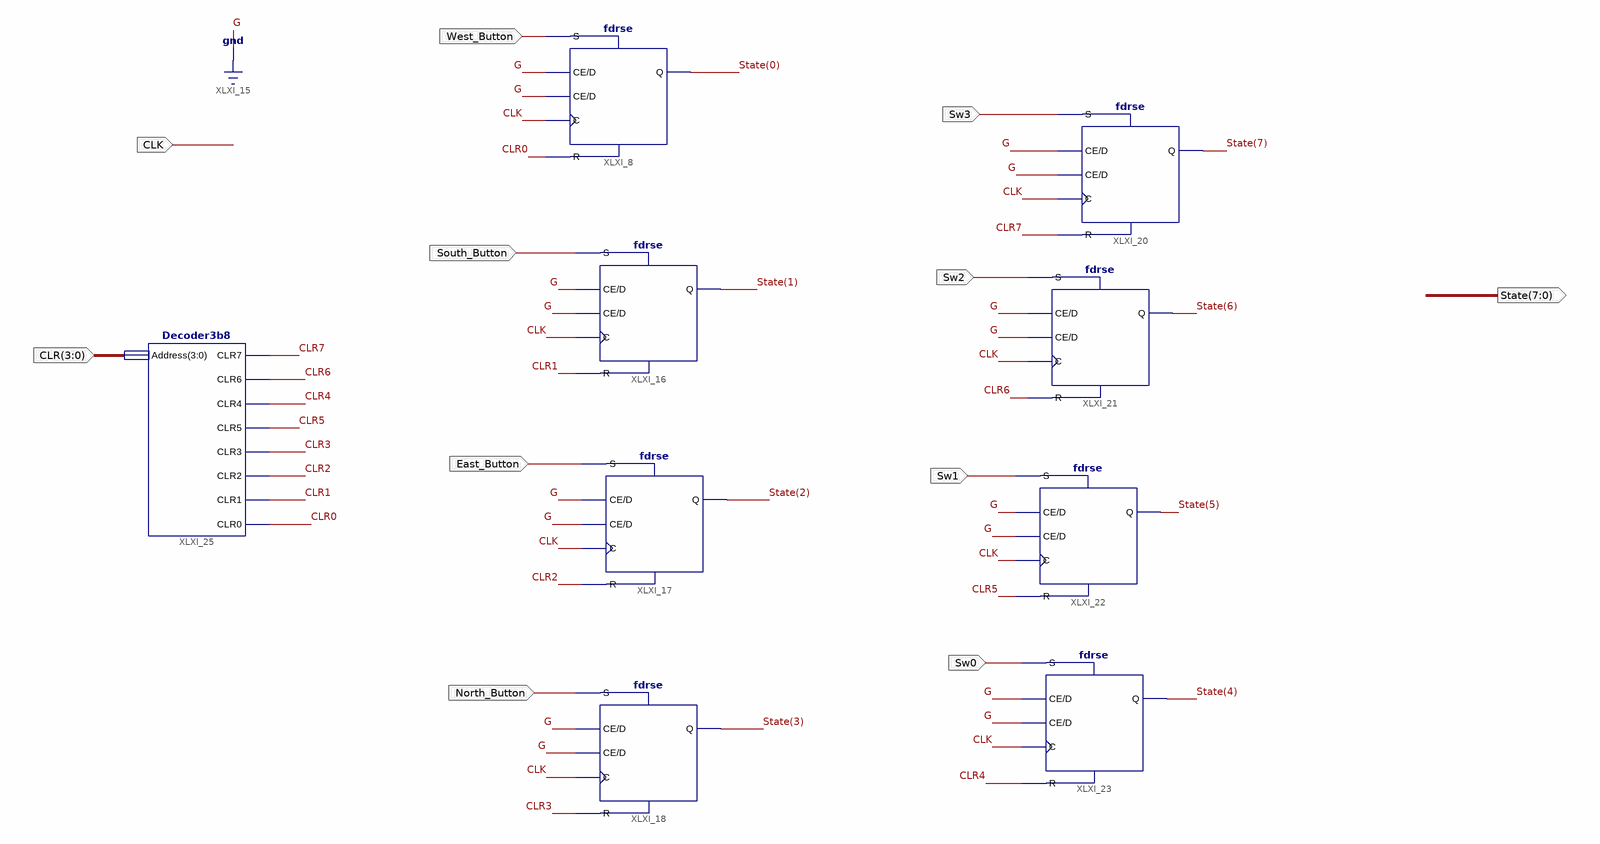
[diagram p0: schematic sheet 1]
// Xilinx ISE schematic Interrupt_Register.sch (spartan3e) as structural Verilog: 9 symbols, 11 ports
module Interrupt_Register (
  input  [3:0] CLR,
  input  CLK,
  input  West_Button,
  input  South_Button,
  input  East_Button,
  input  Sw1,
  input  Sw2,
  input  Sw3,
  input  North_Button,
  input  Sw0,
  output [7:0] State
);

  wire CLR0, CLR1, CLR2, CLR3, CLR4, CLR5, CLR6, CLR7;

  fdrse XLXI_8 (.C(CLK), .CE(1'b0), .D(1'b0), .R(CLR0), .S(West_Button), .Q(State[0]));
  fdrse XLXI_16 (.C(CLK), .CE(1'b0), .D(1'b0), .R(CLR1), .S(South_Button), .Q(State[1]));
  fdrse XLXI_17 (.C(CLK), .CE(1'b0), .D(1'b0), .R(CLR2), .S(East_Button), .Q(State[2]));
  fdrse XLXI_21 (.C(CLK), .CE(1'b0), .D(1'b0), .R(CLR6), .S(Sw2), .Q(State[6]));
  fdrse XLXI_22 (.C(CLK), .CE(1'b0), .D(1'b0), .R(CLR5), .S(Sw1), .Q(State[5]));
  fdrse XLXI_23 (.C(CLK), .CE(1'b0), .D(1'b0), .R(CLR4), .S(Sw0), .Q(State[4]));
  fdrse XLXI_18 (.C(CLK), .CE(1'b0), .D(1'b0), .R(CLR3), .S(North_Button), .Q(State[3]));
  Decoder3b8 XLXI_25 (
    .Address(CLR), .CLR7(CLR7), .CLR6(CLR6), .CLR4(CLR4), .CLR5(CLR5), .CLR3(CLR3), .CLR2(CLR2), .CLR1(CLR1),
    .CLR0(CLR0));
  fdrse XLXI_20 (.C(CLK), .CE(1'b0), .D(1'b0), .R(CLR7), .S(Sw3), .Q(State[7]));
endmodule
